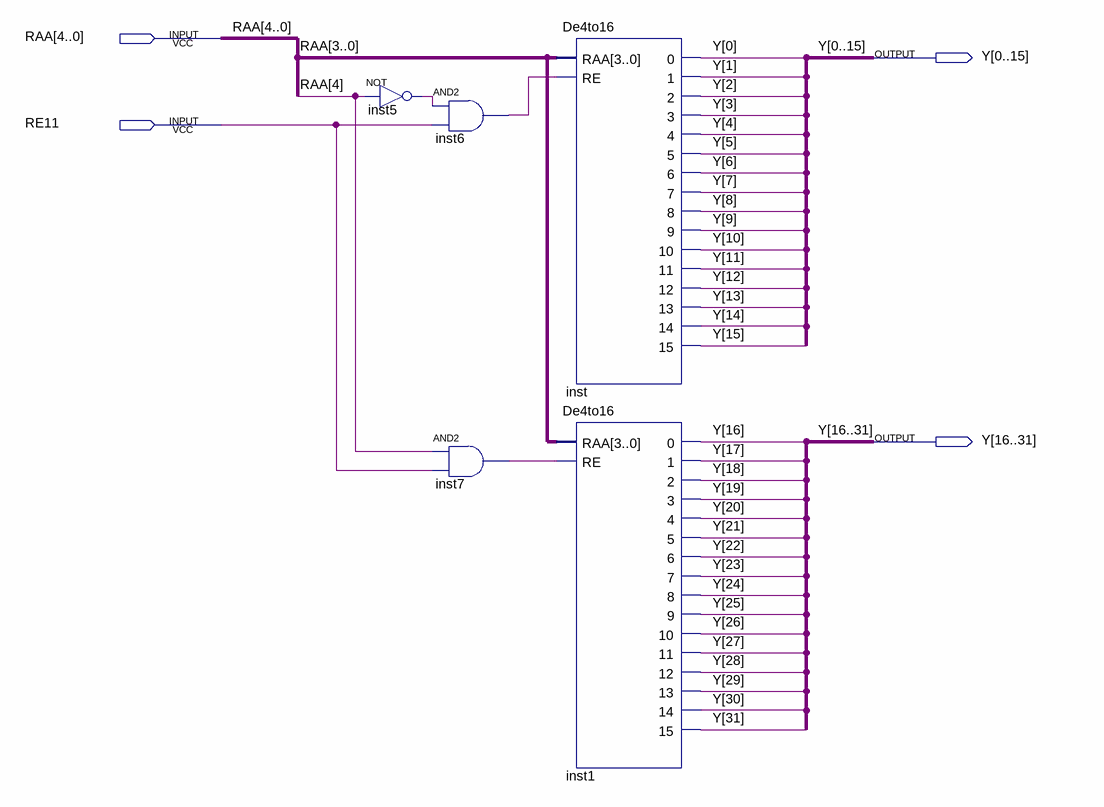
[diagram p0: schematic sheet]
// Quartus schematic De5to32.bdf as structural Verilog: 5 symbols, 4 pins
module De5to32 (
  input  [4:0] RAA,
  input  RE11,
  output [0:31] Y
);

  wire inst5_out, inst6_out, inst7_out;

  not inst5 (inst5_out, RAA[4]);
  and inst6 (inst6_out, inst5_out, RE11);
  and inst7 (inst7_out, RAA[4], RE11);
  De4to16 inst (
    .RAA(RAA[3:0]), .RE(inst6_out), .\0 (Y[0]), .\1 (Y[1]), .\2 (Y[2]), .\3 (Y[3]), .\4 (Y[4]), .\5 (Y[5]),
    .\6 (Y[6]), .\7 (Y[7]), .\8 (Y[8]), .\9 (Y[9]), .\10 (Y[10]), .\11 (Y[11]), .\12 (Y[12]), .\13 (Y[13]),
    .\14 (Y[14]), .\15 (Y[15]));
  De4to16 inst1 (
    .RAA(RAA[3:0]), .RE(inst7_out), .\0 (Y[16]), .\1 (Y[17]), .\2 (Y[18]), .\3 (Y[19]), .\4 (Y[20]),
    .\5 (Y[21]), .\6 (Y[22]), .\7 (Y[23]), .\8 (Y[24]), .\9 (Y[25]), .\10 (Y[26]), .\11 (Y[27]),
    .\12 (Y[28]), .\13 (Y[29]), .\14 (Y[30]), .\15 (Y[31]));
endmodule
